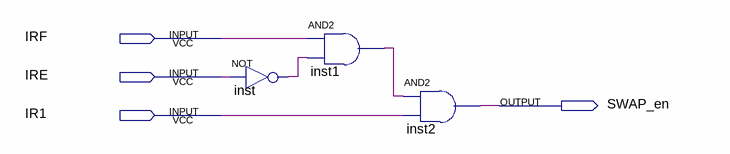
[diagram p0: schematic sheet]
// Quartus schematic SWAP_EN.bdf as structural Verilog: 3 symbols, 4 pins
module SWAP_EN (
  input  IRF,
  input  IRE,
  input  IR1,
  output SWAP_en
);

  wire inst1_out, inst_out;

  not inst (inst_out, IRE);
  and inst1 (inst1_out, IRF, inst_out);
  and inst2 (SWAP_en, inst1_out, IR1);
endmodule
